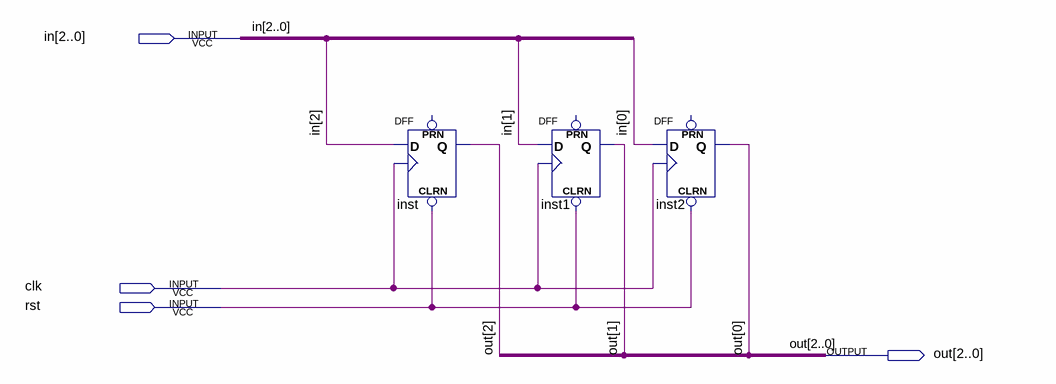
[diagram p0: schematic sheet]
// Quartus schematic threeBitReg.bdf as structural Verilog: 3 symbols, 4 pins
module threeBitReg (
  input  [2:0] in,
  input  clk,
  input  rst,
  output [2:0] out
);

  DFF inst (.CLRN(rst), .CLK(clk), .D(in[2]), .Q(out[2]));  // open: PRN
  DFF inst1 (.CLRN(rst), .CLK(clk), .D(in[1]), .Q(out[1]));  // open: PRN
  DFF inst2 (.CLRN(rst), .CLK(clk), .D(in[0]), .Q(out[0]));  // open: PRN
endmodule
